# Altium schematic sheet USBHUB-FE1.1S.SchDoc
size A3
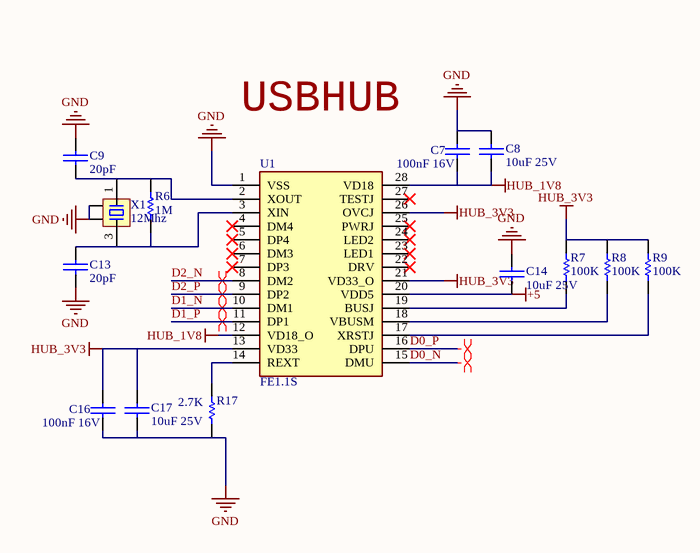
[diagram p0: USBHUB-FE1.1S.SchDoc]

## Parts
C7  100nF 16V  [0402C]
C8  10uF 25V  [0805C]
C9  20pF  [0402C]
C13  20pF  [0402C]
C14  10uF 25V  [0805C]
C16  100nF 16V  [0402C]
C17  10uF 25V  [0805C]
R6  1M  [0402R]
R7  100K  [0402R]
R8  100K  [0402R]
R9  100K  [0402R]
R17  2.7K  [0402R]
U1  FE1.1S  [SOP64P600X175-28N]
X1  12Mhz  [OSC 3225-4P]

## Nets
+5: C14.2 U1.20(VDD5)
GND: C7.2 C8.1 C9.2 C13.1 C14.1 C16.1 C17.2 R17.1 U1.1(VSS) X1.2 X1.4
HUB_1V8: C7.1 C8.2 U1.12(VD18_O) U1.28(VD18)
HUB_3V3: C16.2 C17.1 R7.2 R8.2 R9.2 U1.13(VD33) U1.21(VD33_O) U1.26(OVCJ)
D0_N: U1.15(DMU)
D0_P: U1.16(DPU)
D1_N: U1.10(DM1)
D1_P: U1.11(DP1)
D2_N: U1.8(DM2)
D2_P: U1.9(DP2)
NetC9_1: C9.1 R6.2 U1.2(XOUT) X1.1
NetC13_2: C13.2 R6.1 U1.3(XIN) X1.3
NetR7_1: R7.1 U1.19(BUSJ)
NetR8_1: R8.1 U1.18(VBUSM)
NetR9_1: R9.1 U1.17(XRSTJ)
NetR17_2: R17.2 U1.14(REXT)

Not connected (* = marked no-connect by the designer): U1 4(DM4)* 5(DP4)* 6(DM3)* 7(DP3)* 22(DRV)* 23(LED1)* 24(LED2)* 25(PWRJ)* 27(TESTJ)*

## Layout directives
differential pair: D0_N, D0_P, D1_N, D1_P, D2_N, D2_P

## Notes on the sheet
- USBHUB

## Library data of the parts
C7-C9 C13 C14 C16 C17 = CAP-NP
R6-R9 R17 = RES
U1 = FE1.1S: Integrated Circuit; Manufacturer_Name: JFD IC; Datasheet Link: https://cdn-shop.adafruit.com/product-files/2991/FE1.1s+Data+Sheet+(Rev.+1.0).pdf; Height: 1.75mm; Manufacturer_Part_Number: FE1.1S
X1 = XTAL-4P